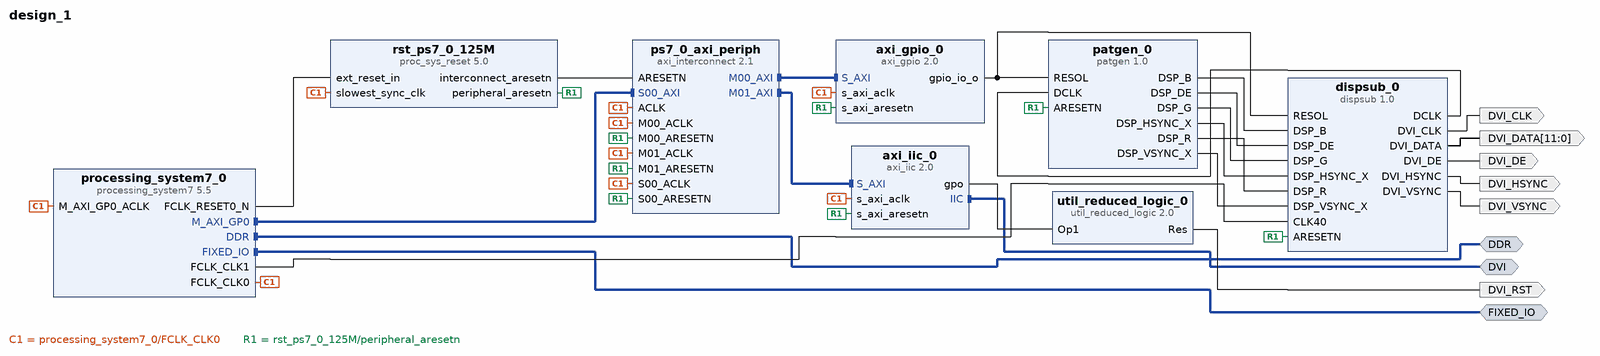
[diagram p0: block diagram of the top level]
# Vivado block design design_1, xc7z020clg484-1, Vivado 2016.4
create_bd_design design_1

create_bd_intf_port -mode Master -vlnv xilinx.com:interface:ddrx_rtl:1.0 DDR
create_bd_intf_port -mode Master -vlnv xilinx.com:interface:iic_rtl:1.0 DVI
create_bd_intf_port -mode Master -vlnv xilinx.com:display_processing_system7:fixedio_rtl:1.0 FIXED_IO
create_bd_port -dir O DVI_CLK
create_bd_port -dir O -from 11 -to 0 DVI_DATA
create_bd_port -dir O DVI_DE
create_bd_port -dir O DVI_HSYNC
create_bd_port -dir O DVI_RST
create_bd_port -dir O DVI_VSYNC

create_bd_cell -type ip -vlnv xilinx.com:ip:axi_gpio:2.0 axi_gpio_0
set_property -dict {CONFIG.C_GPIO_WIDTH 2 CONFIG.C_ALL_OUTPUTS 1} [get_bd_cells axi_gpio_0]
create_bd_cell -type ip -vlnv xilinx.com:ip:axi_iic:2.0 axi_iic_0
create_bd_cell -type ip -vlnv xilinx.com:user:dispsub:1.0 dispsub_0
create_bd_cell -type ip -vlnv xilinx.com:ip:processing_system7:5.5 processing_system7_0
set_property -dict [list \
  CONFIG.PCW_FPGA0_PERIPHERAL_FREQMHZ 125 \
  CONFIG.PCW_FPGA1_PERIPHERAL_FREQMHZ 40 \
  CONFIG.PCW_EN_CLK1_PORT 1 \
  CONFIG.preset ZC702 \
] [get_bd_cells processing_system7_0]
create_bd_cell -type ip -vlnv xilinx.com:ip:axi_interconnect:2.1 ps7_0_axi_periph
set_property -dict {CONFIG.NUM_MI 2} [get_bd_cells ps7_0_axi_periph]
create_bd_cell -type ip -vlnv xilinx.com:ip:proc_sys_reset:5.0 rst_ps7_0_125M
create_bd_cell -type ip -vlnv xilinx.com:ip:util_reduced_logic:2.0 util_reduced_logic_0
set_property -dict {CONFIG.C_SIZE 1} [get_bd_cells util_reduced_logic_0]
create_bd_cell -type ip -vlnv xilinx.com:user:patgen:1.0 patgen_0

# ---- connections ----

connect_bd_intf_net [get_bd_intf_pins processing_system7_0/M_AXI_GP0] [get_bd_intf_pins ps7_0_axi_periph/S00_AXI]
connect_bd_intf_net [get_bd_intf_pins axi_gpio_0/S_AXI] [get_bd_intf_pins ps7_0_axi_periph/M00_AXI]
connect_bd_intf_net [get_bd_intf_pins axi_iic_0/S_AXI] [get_bd_intf_pins ps7_0_axi_periph/M01_AXI]
connect_bd_intf_net [get_bd_intf_ports DDR] [get_bd_intf_pins processing_system7_0/DDR]
connect_bd_intf_net [get_bd_intf_ports DVI] [get_bd_intf_pins axi_iic_0/IIC]
connect_bd_intf_net [get_bd_intf_ports FIXED_IO] [get_bd_intf_pins processing_system7_0/FIXED_IO]
connect_bd_net [get_bd_pins axi_gpio_0/gpio_io_o] [get_bd_pins dispsub_0/RESOL] [get_bd_pins patgen_0/RESOL]
connect_bd_net [get_bd_pins axi_iic_0/gpo] [get_bd_pins util_reduced_logic_0/Op1]
connect_bd_net [get_bd_pins dispsub_0/DCLK] [get_bd_pins patgen_0/DCLK]
connect_bd_net [get_bd_pins dispsub_0/DVI_CLK] [get_bd_ports DVI_CLK]
connect_bd_net [get_bd_pins dispsub_0/DVI_DATA] [get_bd_ports DVI_DATA]
connect_bd_net [get_bd_pins dispsub_0/DVI_DE] [get_bd_ports DVI_DE]
connect_bd_net [get_bd_pins dispsub_0/DVI_HSYNC] [get_bd_ports DVI_HSYNC]
connect_bd_net [get_bd_pins dispsub_0/DVI_VSYNC] [get_bd_ports DVI_VSYNC]
connect_bd_net [get_bd_pins patgen_0/DSP_B] [get_bd_pins dispsub_0/DSP_B]
connect_bd_net [get_bd_pins patgen_0/DSP_DE] [get_bd_pins dispsub_0/DSP_DE]
connect_bd_net [get_bd_pins patgen_0/DSP_G] [get_bd_pins dispsub_0/DSP_G]
connect_bd_net [get_bd_pins patgen_0/DSP_HSYNC_X] [get_bd_pins dispsub_0/DSP_HSYNC_X]
connect_bd_net [get_bd_pins patgen_0/DSP_R] [get_bd_pins dispsub_0/DSP_R]
connect_bd_net [get_bd_pins patgen_0/DSP_VSYNC_X] [get_bd_pins dispsub_0/DSP_VSYNC_X]
connect_bd_net [get_bd_pins processing_system7_0/FCLK_CLK0] \
  [get_bd_pins axi_gpio_0/s_axi_aclk] [get_bd_pins axi_iic_0/s_axi_aclk] [get_bd_pins processing_system7_0/M_AXI_GP0_ACLK] \
  [get_bd_pins ps7_0_axi_periph/ACLK] [get_bd_pins ps7_0_axi_periph/M00_ACLK] [get_bd_pins ps7_0_axi_periph/M01_ACLK] \
  [get_bd_pins ps7_0_axi_periph/S00_ACLK] [get_bd_pins rst_ps7_0_125M/slowest_sync_clk]
connect_bd_net [get_bd_pins processing_system7_0/FCLK_CLK1] [get_bd_pins dispsub_0/CLK40]
connect_bd_net [get_bd_pins processing_system7_0/FCLK_RESET0_N] [get_bd_pins rst_ps7_0_125M/ext_reset_in]
connect_bd_net [get_bd_pins rst_ps7_0_125M/interconnect_aresetn] [get_bd_pins ps7_0_axi_periph/ARESETN]
connect_bd_net [get_bd_pins rst_ps7_0_125M/peripheral_aresetn] \
  [get_bd_pins axi_gpio_0/s_axi_aresetn] [get_bd_pins axi_iic_0/s_axi_aresetn] [get_bd_pins dispsub_0/ARESETN] \
  [get_bd_pins ps7_0_axi_periph/M00_ARESETN] [get_bd_pins ps7_0_axi_periph/M01_ARESETN] \
  [get_bd_pins ps7_0_axi_periph/S00_ARESETN] [get_bd_pins patgen_0/ARESETN]
connect_bd_net [get_bd_pins util_reduced_logic_0/Res] [get_bd_ports DVI_RST]

# ---- address map ----
assign_bd_address -offset 0x41200000 -range 64K -target_address_space [get_bd_addr_spaces processing_system7_0/Data] [get_bd_addr_segs axi_gpio_0/S_AXI/Reg]
assign_bd_address -offset 0x41600000 -range 64K -target_address_space [get_bd_addr_spaces processing_system7_0/Data] [get_bd_addr_segs axi_iic_0/S_AXI/Reg]

validate_bd_design
save_bd_design
